# EAGLE board artik530_carrierboard (EAGLE 9.0.0)
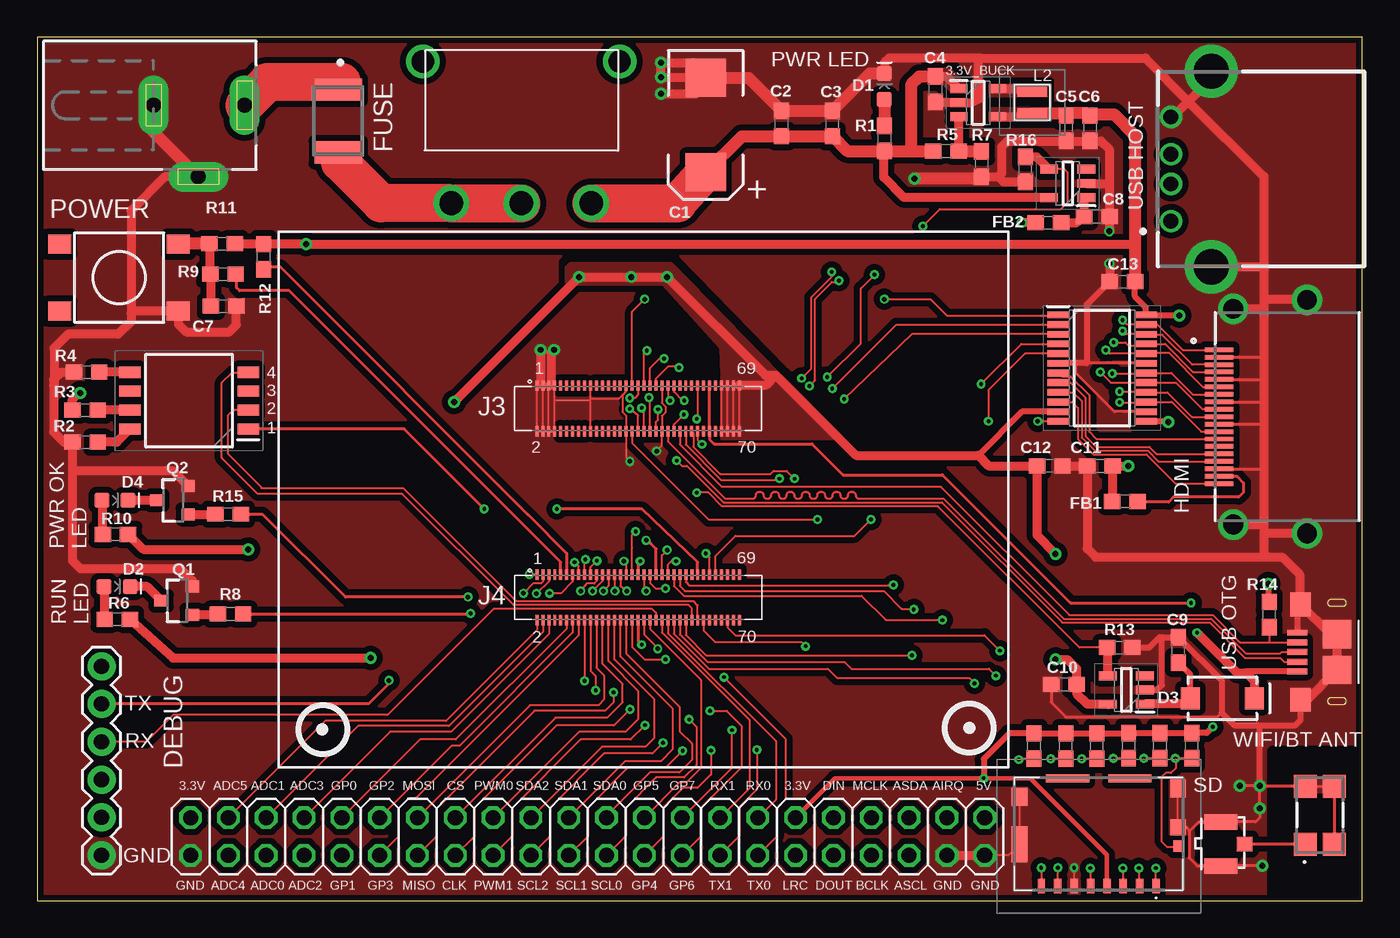
[diagram p4: board, top side]
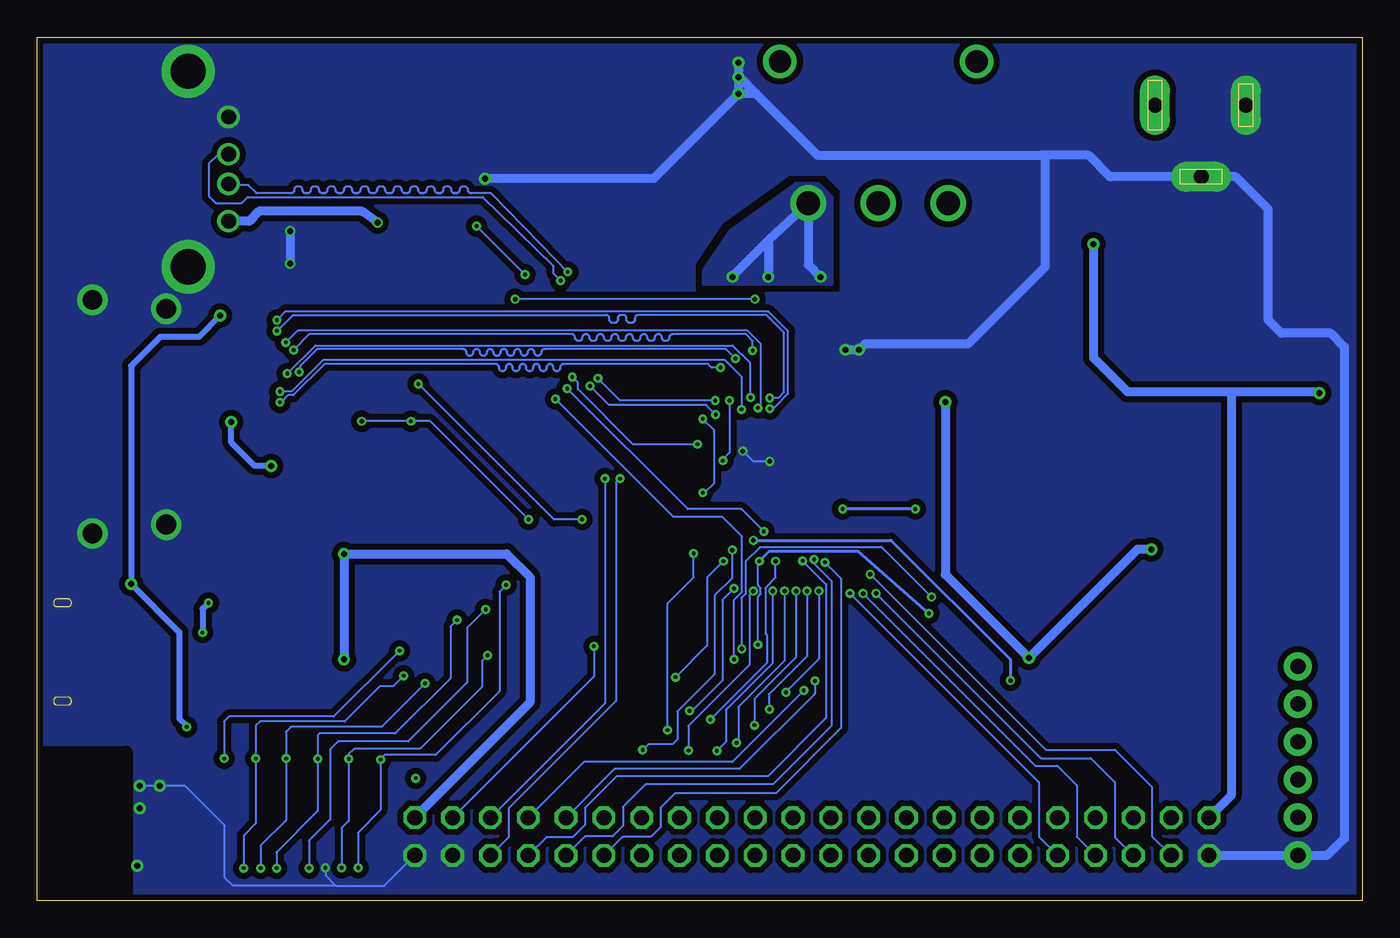
[diagram p5: board, bottom side, seen from below]

Size 89 x 58 mm. Coordinates in mm from the lower left corner, seen from the top.
Outline: 0,0 89,0 89,58 0,58 0,0
Copper layers (1*16): Top 0.035559375mm / dielectric 1.6mm / Bottom 0.035559375mm
Design rules "oshpark-2layer *": minimum track width 5mil, minimum drill 10mil, track to track 5mil, track to pad 5mil, pad to pad 5mil, via to via 5mil, smd to smd 5mil, copper to edge 15mil, drill to drill 6mil, minimum pad ring 5mil, minimum via ring 5mil, stop-mask expansion 2.5mil, vias tented up to drill 16mil, thermal gap 10mil
Net classes: 1 differential: width 0.127 mm, drill 0.3 mm, clearance 0.127 mm
bKeepout: area 78.2,2.9 to 83,4.7
tRestrict: area 78.1,2.9 to 80.4,4.7; area 83,8.6 to 89,10; area 83,7.9 to 84.3,8.6; area 83,0 to 89,2.8; area 83,4 to 84.3,7.4; area 83,2.8 to 84.3,3.6; area 84.3,4.7 to 86.9,6.8; area 87.3,4.7 to 89,6.8; area 88,6.8 to 89,8.6; area 88,2.7 to 89,4.7
bRestrict: area 83,0 to 89,10

## Footprints (pad centres in the part's own frame; a part is rotated, then mirrored left to right if it is on the bottom)
SOT95P284X122-5N = smd 1.15 x 0.6: 1 -1.3,0.953; 2 -1.3,0; 3 -1.3,-0.953; 4 1.3,-0.953; 5 1.3,0.953
146175-0001 = smd 1.54 x 1.54: 1 -0.97,-1.95; 2 0.97,-1.95; 3 0.97,1.95; 4 -0.97,1.95
EIA7343 = smd 2.55 x 2.7: A 3.17,0; C -3.17,0
0603 = smd 1.1 x 1: 1 -0.85,0; 2 0.85,0
LED-0603 = smd 1 x 1: A -0.877,0; C 0.877,0
SMA-DIODE = smd 1.27 x 1.47: A -2.15,0; C 2.15,0
MF-MSMF260-2 = smd 1.5 x 3.2: 1 -2.1,0; 2 2.1,0
SOT95P280X145-5N = smd 1.2 x 0.6: 1 -1.25,0.95; 2 -1.25,0; 3 -1.25,-0.95; 4 1.25,-0.95; 5 1.25,0.95
SOP65P640X120-24N = smd 1.475 x 0.45: 1 -2.938,3.575; 2 -2.938,2.925; 3 -2.938,2.275; 4 -2.938,1.625; 5 -2.938,0.975; 6 -2.938,0.325; 7 -2.938,-0.325; 8 -2.938,-0.975; 9 -2.938,-1.625; 10 -2.938,-2.275; 11 -2.938,-2.925; 12 -2.938,-3.575; 13 2.938,-3.575; 14 2.938,-2.925; 15 2.938,-2.275; 16 2.938,-1.625; 17 2.938,-0.975; 18 2.938,-0.325; 19 2.938,0.325; 20 2.938,0.975; 21 2.938,1.625; 22 2.938,2.275; 23 2.938,2.925; 24 2.938,3.575
DCJ0202 = drill 1 pad 2 long: 1 0,3.1; 2 4.8,0; 3 0,-3
10118193-0001LF = smd 0.4 x 1.35: D+ 0,2.675; D- -0.65,2.675; GND 1.3,2.675; ID 0.65,2.675; VCC -1.3,2.675 | smd 1.6 x 1.4: SHIELD$1 -3.2,2.45; SHIELD$2 3.2,2.45 | smd 1.9 x 1.9: SHIELD$3 -1.2,0; SHIELD$4 1.2,0
DF40C(2.0)-70DS-0.4V(51) = smd 0.2 x 0.7: 1 0,0; 2 0,-3.08; 3 0.4,0; 4 0.4,-3.08; 5 0.8,0; 6 0.8,-3.08; 7 1.2,0; 8 1.2,-3.08; 9 1.6,0; 10 1.6,-3.08; 11 2,0; 12 2,-3.08; 13 2.4,0; 14 2.4,-3.08; 15 2.8,0; 16 2.8,-3.08; 17 3.2,0; 18 3.2,-3.08; 19 3.6,0; 20 3.6,-3.08; 21 4,0; 22 4,-3.08; 23 4.4,0; 24 4.4,-3.08; 25 4.8,0; 26 4.8,-3.08; 27 5.2,0; 28 5.2,-3.08; 29 5.6,0; 30 5.6,-3.08; 31 6,0; 32 6,-3.08; 33 6.4,0; 34 6.4,-3.08; 35 6.8,0; 36 6.8,-3.08; 37 7.2,0; 38 7.2,-3.08; 39 7.6,0; 40 7.6,-3.08; 41 8,0; 42 8,-3.08; 43 8.4,0; 44 8.4,-3.08; 45 8.8,0; 46 8.8,-3.08; 47 9.2,0; 48 9.2,-3.08; 49 9.6,0; 50 9.6,-3.08; 51 10,0; 52 10,-3.08; 53 10.4,0; 54 10.4,-3.08; 55 10.8,0; 56 10.8,-3.08; 57 11.2,0; 58 11.2,-3.08; 59 11.6,0; 60 11.6,-3.08; 61 12,0; 62 12,-3.08; 63 12.4,0; 64 12.4,-3.08; 65 12.8,0; 66 12.8,-3.08; 67 13.2,0; 68 13.2,-3.08; 69 13.6,0; 70 13.6,-3.08
UE27AC54100 = drill 1 pad 1.5: 1 -3.5,0; 2 -1,0; 3 1,0; 4 3.5,0 | drill 2.38 pad 3.58: 5 -6.57,-2.71; 6 6.57,-2.71
FTDI_BASIC = drill 1.016 pad 1.88: CTS 10.16,0; DTR 0,0; GND 12.7,0; RXI 2.54,0; TXO 5.08,0; VCC 7.62,0
10029449-111RLF_1 = smd 0.3 x 1.9: 1 4.5,0.95; 2 4,0.95; 3 3.5,0.95; 4 3,0.95; 5 2.5,0.95; 6 2,0.95; 7 1.5,0.95; 8 1,0.95; 9 0.5,0.95; 10 0,0.95; 11 -0.5,0.95; 12 -1,0.95; 13 -1.5,0.95; 14 -2,0.95; 15 -2.5,0.95; 16 -3,0.95; 17 -3.5,0.95; 18 -4,0.95; 19 -4.5,0.95 | drill 1.33 pad 2.03: 20 -7.25,0; 21 -7.85,-4.95; 22 7.85,-4.95; 23 7.25,0
1051620001 = smd 0.5 x 1: 1 3.85,-3.335; 2 2.75,-3.335; 3 1.65,-3.335; 4 0.55,-3.335; 5 -0.55,-3.335; 6 -1.65,-3.335; 7 -2.75,-3.335; 8 -3.85,-3.335 | smd 0.72 x 0.78: 9 5.36,-0.655 | smd 1.05 x 1.08: 10 5.325,0.615 | smd 1.05 x 1.2: 11 5.325,3.225; 12 -5.325,2.655 | smd 1.05 x 2.39: 13 -5.325,-0.53 | smd 2.91 x 0.55: 14 -2.095,3.9; 15 2.095,3.9
NRH2412T2R2MNGH = smd 0.7 x 2: 1 -0.725,0; 2 0.725,0
SOT23-3 = smd 0.8 x 0.9: 1 -0.95,-1; 2 0.95,-1; 3 0,1.1
TACTILE_SWITCH_SMD_6.2MM_TALL = smd 1.55 x 1.3: A1 -3.975,-2.25; A2 3.975,-2.25; B1 -3.975,2.25; B2 3.975,2.25
SOIC127P844X265-8N = smd 1.45 x 0.75: 1 -3.975,1.905; 2 -3.975,0.635; 3 -3.975,-0.635; 4 -3.975,-1.905; 5 3.975,-1.905; 6 3.975,-0.635; 7 3.975,0.635; 8 3.975,1.905
2X22 = drill 1.016 octagon: 1 -25.4,-1.27; 2 -25.4,1.27; 3 -22.86,-1.27; 4 -22.86,1.27; 5 -20.32,-1.27; 6 -20.32,1.27; 7 -17.78,-1.27; 8 -17.78,1.27; 9 -15.24,-1.27; 10 -15.24,1.27; 11 -12.7,-1.27; 12 -12.7,1.27; 13 -10.16,-1.27; 14 -10.16,1.27; 15 -7.62,-1.27; 16 -7.62,1.27; 17 -5.08,-1.27; 18 -5.08,1.27; 19 -2.54,-1.27; 20 -2.54,1.27; 21 0,-1.27; 22 0,1.27; 23 2.54,-1.27; 24 2.54,1.27; 25 5.08,-1.27; 26 5.08,1.27; 27 7.62,-1.27; 28 7.62,1.27; 29 10.16,-1.27; 30 10.16,1.27; 31 12.7,-1.27; 32 12.7,1.27; 33 15.24,-1.27; 34 15.24,1.27; 35 17.78,-1.27; 36 17.78,1.27; 37 20.32,-1.27; 38 20.32,1.27; 39 22.86,-1.27; 40 22.86,1.27; 41 25.4,-1.27; 42 25.4,1.27; 43 27.94,-1.27; 44 27.94,1.27
500SSP1S1M6QEA = drill 1.6: 1 -4.8,-5.4; 2 -0.1,-5.4; 3 4.6,-5.4 | drill 1.5: 4 -6.705,4.13; 5 6.505,4.13
U.FL-R-SMT(10) = smd 1.05 x 2.2: 1 -1.475,0.2; 2 1.475,0.2 | smd 1 x 1.05: 3 0,-1.4

## Placement (x,y rotation side)
3.3V_BUCK  LM3671MF-3.3_NOPB  [SOT95P284X122-5N]  63.2,53.6 0 top
ANT1  146175-0001  [146175-0001]  86.16,5.74 0 top
C1  100uF  [EIA7343]  44.9,52.1 270 top
C2  10uF  [0603]  50,52.2 90 top
C3  0.1uF  [0603]  53.4,52.2 90 top
C4  4.7uF  [0603]  60.33,54.51 270 top
C5  10uF  [0603]  69.11,51.88 270 top
C6  0.1uF  [0603]  70.71,51.88 270 top
C7  1.0uF  [0603]  12.52,39.93 180 top
C8  4.7uF  [0603]  71.17,45.94 0 top
C9  4.7uF  [0603]  76.64,16.84 90 top
C10  10uF  [0603]  68.95,14.54 180 top
C11  0.1uF  [0603]  71.37,29.2 180 top
C12  0.1uF  [0603]  68,29.2 0 top
C13  0.1uF  [0603]  72.89,41.58 180 top
D1  Red  [LED-0603]  56.9,54.7 90 top
D2  GREEN  [LED-0603]  5.37,21.1 0 top
D3  3A/40V/500mV  [SMA-DIODE]  79.6,13.59 0 top
D4  BLUE  [LED-0603]  5.23,26.89 0 top
F1  MF-MSMF260-2  [MF-MSMF260-2]  20.22,52.37 270 top
FB1  120Ω  [0603]  73.06,26.81 0 top
FB2  30Ω  [0603]  67.92,45.54 180 top
IC2  TPS2051BDBVR  [SOT95P280X145-5N]  73.15,14.15 180 top
IC3  TPD12S016PWR  [SOP65P640X120-24N]  71.52,35.77 0 top
IC4  TPS2051BDBVR  [SOT95P280X145-5N]  69.21,48.18 180 top
J1  DCJ0202  [DCJ0202]  10.82,53.43 270 top
J2  10118193-0001LF  [10118193-0001LF]  87.3,16.7 90 top
J3  DF40C(2.0)-70DS-0.4V(51)  [DF40C(2.0)-70DS-0.4V(51)]  33.56,34.6 0 top
J4  DF40C(2.0)-70DS-0.4V(51)  [DF40C(2.0)-70DS-0.4V(51)]  33.56,21.91 0 top
J5  UE27AC54100  [UE27AC54100]  76.15,49.14 90 top
J6  6_PIN_SERIAL_CABLEPTH  [FTDI_BASIC]  4.32,15.74 270 top
J7  10029449-111RLF  [10029449-111RLF_1]  80.34,32.51 90 top
J8  1051620001  [1051620001]  71.3,4.31 0 top
L2  NRH2412T2R2MNGH  [NRH2412T2R2MNGH]  66.83,53.61 270 top
Q1  600mA/40V  [SOT23-3]  9.42,20.15 90 top
Q2  600mA/40V  [SOT23-3]  9.14,26.89 90 top
R1  470  [0603]  56.9,51.2 270 top
R2  1k  [0603]  3.21,30.8 180 top
R3  1k  [0603]  3.21,32.95 180 top
R4  1k  [0603]  3.31,35.5 180 top
R5  10k  [0603]  61.03,50.35 180 top
R6  470  [0603]  5.38,18.9 0 top
R7  100k  [0603]  63.43,49.48 270 top
R8  10k  [0603]  12.98,19.25 0 top
R9  33  [0603]  12.48,42.07 0 top
R10  470  [0603]  5.26,24.61 0 top
R11  100k  [0603]  12.42,44.13 180 top
R12  100k  [0603]  15.21,43.25 270 top
R13  10k  [0603]  72.7,17 180 top
R14  100k  [0603]  82.75,19.21 90 top
R15  10k  [0603]  12.83,25.95 0 top
R16  100k  [0603]  66.37,49.12 90 top
R17  10k  [0603]  77.54,10.41 90 top
R18  51k  [0603]  66.95,10.38 90 top
R19  51k  [0603]  71.17,10.38 90 top
R20  10k  [0603]  69.09,10.38 90 top
R21  51k  [0603]  75.41,10.41 90 top
R22  51k  [0603]  73.3,10.41 90 top
S1  MOMENTARY-SWITCH-SPST-SMD-6.2MM-TALL  [TACTILE_SWITCH_SMD_6.2MM_TALL]  5.5,41.85 0 top
S3  218-4LPST  [SOIC127P844X265-8N]  10.2,33.59 180 top
SV1  TEST HEADER  [2X22]  35.7,4.3 0 top
SW1  500SSP1S1M6QEA  [500SSP1S1M6QEA]  32.61,52.25 0 top
U$3  U.FL-R-SMT(10)  [U.FL-R-SMT(10)]  79.69,3.8 90 top

## Tracks (layer width: path | path; a pad name or v marks a point on that pad's centre or on a via)
3.3V  (via drill 0.25 pad 0.6, 0.4 pad 0.8)
  Top 0.127: 74.4,39.4 IC3.24
  Top 0.305: J8.4 71.85,3.08 66.7,8.23 v63.57,8.23 53.59,8.23 SV1.34 | 73.28,11.23 R22.2
  Top 0.406: C13.1 73.74,40.56 74.46,39.84 IC3.24 76.66,39.34 v76.7,39.3 | v82.7,21.28 82.7,20.11 R14.2 | v63.57,8.23 63.57,9.52 65.29,11.23 R18.2 R20.2 R19.2 73.28,11.23 | R22.2 R21.2 R17.2 78.55,11.26 v78.97,11.68
  Top 0.61: R3.2 2.36,33.65 2.8,34.09 v2.9,34.09 | 3.3V_BUCK.4 66.58,52.65 L2.2 | 73.74,44.09 73.73,44.1 v18.05,44.1 15.26,44.1 R12.1 13.3,44.1 R11.1
  Top 0.813: 68.94,52.89 C5.1 | L2.2 68.94,52.89 | 68.94,52.89 70.55,52.89 C6.1 70.78,52.8 72.34,52.8 73.74,51.4 73.74,44.09 C13.1
  Bottom 0.406: v76.7,39.3 78.13,37.87 80.75,37.87 82.7,35.91 v82.7,21.28 79.45,18.03 79.45,12.21 78.97,11.73 v78.97,11.68
  Bottom 0.61: 18.1,44.1 v18.05,44.1 18.05,36.46 15.77,34.18 8.63,34.18 | 8.63,34.18 3,34.18 v2.9,34.09 | 8.63,34.18 8.8,34.02 8.8,7.07 SV1.2
  pour Top (no thermals): 67.82,53.26 67.84,53.23 67.84,52.4 67.87,52.37 64.01,52.37 64.01,53.26 64.03,53.26
5V  (via drill 0.4 pad 0.8)
  Top 0.127: J3.66 J3.65 | J3.68 J3.67 | 47.16,34.5 J3.70 J3.68 | 47.16,34.5 J3.69 | J3.66 J3.64 J3.63 J3.65 | J3.66 J3.68 | J3.65 J3.67 | J3.67 47.06,34.6 47.16,34.5
  Top 0.406: IC3.11 66.14,32.84 63.2,29.9
  Top 0.61: 68.45,23.35 v68.4,23.3 67.16,24.55 C12.1 63.9,29.2 63.2,29.9 55,29.9 49.6,35.3 | v28,33.5 28.1,33.5 28.1,33.6 v36.4,41.9 v39.9,41.9 v42.3,41.9 48.9,35.3 49.6,35.3 | R6.2 9.13,16.3 v22.4,16.3 | 49.6,35.3 48.9,34.6 J3.69 | 3.3V_BUCK.1 61.1,55.36 C4.1 | R10.2 7.12,23.59 v14.17,23.59 | 71.95,13.15 IC2.5 70.54,13.2 69.8,13.93 C10.1 69.8,15.59 69.19,16.2 v68.4,16.2 | IC4.5 58.22,47.23 56.87,48.59 56.87,50.35
  Top 0.813: C1.A 47.32,51.35 C2.1 C3.1 54.4,50.35 56.87,50.35 R1.2 58.77,50.35 | 58.77,50.35 R5.2 | C4.1 59.25,55.36 58.7,54.81 58.7,50.43 58.77,50.35
  Top 2.54: SW1.3 43.02,46.85 C1.A
  Bottom 0.61: v68.4,16.2 v68.4,23.3 57.47,23.3 55.9,21.74 55.9,13.31 SV1.44 | v28,33.5 28,21.9 v22.4,16.3 15.11,23.59 v14.17,23.59 | v36.4,41.9 37.21,42.71 SW1.3 39.9,44.36 | 39.9,44.36 v39.9,41.9 | 39.9,44.36 42.26,42 42.3,42 v42.3,41.9
  pour Top (no thermals): 45.94,35.3 45.94,31 53.9,31 54.06,31.2 50,35.3
  pour Bottom (no thermals): 38.05,48.2 42.44,45.03 44.29,42.3 44.29,41.44 44.3,41.43 35.63,41.43 35.59,41.39 35.59,47.26 36.49,48.16
  pour Top (no thermals): 45.99,35.42 45.93,37.1 42,41.4 42,41.59 41.97,41.39 35.69,41.39 35.56,41.52 35.56,42.58 35.79,42.81 42.59,42.81 49.87,35.38 46.1,35.43
  pour Top (no thermals): 59.87,55.9 61.29,55.9 62.41,54.78 62.41,54.3 61.39,54.3 60.83,54.86 59.87,54.86
GND  (via drill 0.25 pad 0.6, 0.3 pad 0.6, 0.4, 0.4 pad 0.8)
  Top 0.127: 74.5,32.8 IC3.14 | J3.4 J3.3 J3.5 | J3.6 J3.5 | 34.76,33.6 J3.8 J3.6 | 34.76,33.6 J3.7 34.5,34.6 J3.5 | 69,36.09 IC3.6 | J3.20 37.16,33.6 | 37.16,33.6 37.16,33.7 | 37.16,33.7 J3.19 | J3.31 39.56,34.22 39.31,33.97 | 39.31,33.97 39.31,32.83 39.56,32.58 J3.32 39.56,29.74 v39.8,29.5 | 39.31,33.97 39.04,33.7 37.16,33.7 | 37.16,33.6 34.76,33.6 | J3.43 41.96,33.43 42.19,33.2 42.19,32.8 41.96,32.57 J3.44 41.96,30.56 v41.6,30.2 | 33.8,34.76 33.64,34.6 J3.1 J3.2 J3.4 | J3.6 J3.4 | J8.6 69.65,2.18 69.64,2.18 v69.64,2.2 | SV1.43 65.22,3.03 J8.13 J8.12 | J8.10 J8.11
  Top 0.2: J7.2 82.31,36.51 82.4,36.42 | J7.5 82.36,35.01 82.4,35.05 | J7.8 82.28,33.51 82.4,33.4 | J7.11 82.26,32.01 82.4,31.87 | J7.17 82.3,29.01 82.4,29.1 | IC3.14 72.36,32.84 69.77,35.43 69.77,36.09 | IC3.19 70.5,36.09 | v82.1,7.7 85.17,7.7 ANT1.4 ANT1.3 ANT1.2 | v82.1,7.7 v82.1,6.2 82.1,5.55 81.84,5.28 U$3.2 78,5.27 77.42,4.69 | v82.28,2.34 82.27,2.32 U$3.1 77.91,2.32 77.37,2.87 77.37,4.64 77.42,4.69 | J8.10 77.18,4.93 77.42,4.69 | v82.1,7.7 v80.78,7.7 | C10.2 68.1,13.32 69.09,12.34 79.27,12.34 79.55,12.62
  Top 0.406: C13.2 70.5,40.04 70.5,36.09 69.77,36.09 69,36.09 | J2.SHIELD$2 84.62,19.67 J2.GND | R13.1 74.69,17 75.38,17.69 75.54,17.69 | 75.54,17.69 C9.2 79.55,14.78 79.55,12.62 80.39,11.78 81.99,11.78 | IC2.2 75.21,14.15 75.54,14.47 75.54,17.69 | J2.SHIELD$1 84.86,12.14 84.5,11.78 81.99,11.78 | v82.1,7.7 82.1,11.67 81.99,11.78
  Top 0.61: 87.75,17.9 J2.SHIELD$4 | 1.1,34.62 1.1,34.99 1.6,35.49 2.45,35.49 R4.2 2.7,35.73 | 1.1,34.62 1.1,31.49 1.79,30.8 R2.2 2.36,28.85 | 2.36,28.85 2.36,22.84 2.9,22.3 9.6,22.3 10.42,21.48 Q1.2 | v33.8,37 33.8,34.76 J3.3 | C1.C 44.87,55.3 v41.9,55.3 v41.9,56.3 44.07,56.3 45.1,55.27 | v41.9,54.2 44.23,54.2 45.3,55.27 | v34.7,37 34.5,36.8 34.5,34.6 | J2.SHIELD$4 86.85,17.9 J2.SHIELD$2 84.8,19.95 84.8,21.9 83.62,23.08 82.62,23.08 | J2.SHIELD$4 J2.SHIELD$3 85.3,13.5 J2.SHIELD$1 | C4.2 60.38,53.6 3.3V_BUCK.2 62.7,53.6 63.22,53.84 63.22,56.55 63.32,56.6 | 63.32,56.6 57.21,56.6 56.92,56.31 56.92,55.6 D1.C | J1.2 8.58,48.63 6.3,46.35 6.3,39.47 | 6.3,39.47 6.3,38.91 5.43,38.05 2.08,38.05 1.14,37.1 1.14,34.66 1.1,34.62 | 6.3,39.47 6.43,39.6 S1.A2 9.47,38.73 10.01,38.2 12.9,38.2 13.37,38.66 C7.1 | Q2.2 9.14,28.85 2.36,28.85 | C12.2 70.42,29.2 70.59,29.02 C11.2 70.52,23.65 71.09,23.08 82.62,23.08 | 82.4,42.72 82.4,40.46 | 82.4,40.46 82.4,39.75 | 82.4,39.75 82.4,36.42 82.4,35.05 82.4,33.4 82.4,31.87 82.4,29.1 82.4,25.47 | 82.4,25.47 82.4,24.46 | 82.4,24.46 82.4,23.31 82.62,23.08 | v72.01,42.79 72.04,42.76 C13.2 | 72.01,48.05 72.01,50.47 71.44,51.03 C6.2 C5.2 65.18,51.03 64.79,50.64 64.79,48.87 64.56,48.63 | 72.01,48.05 v72.01,44.98 v72.02,44.99 C8.2 | R7.2 64.56,48.63 | IC4.2 71.88,48.18 72.01,48.05 | R16.1 64.91,48.27 64.56,48.63 | J7.23 82.39,39.76 82.4,39.75 | J7.22 82.5,40.36 82.4,40.46 | J7.21 82.6,24.66 82.4,24.46 | J7.20 82.18,25.26 82.4,25.47 | J5.5 82.25,42.57 82.4,42.72 | 63.32,56.6 74.43,56.6 77.32,53.67 | 77.32,53.67 82.4,48.64 82.4,42.72 | 77.32,53.67 78.86,55.26 J5.6 | 77.32,53.67 76.24,52.64 J5.4
  Top 0.61: SV1.41 SV1.43
  Top 0.813: C1.C 45.1,55.27 45.3,55.27 47.78,55.27 C2.2 C3.2 55.93,55.58 D1.C 56.92,55.6 | J1.3 7.82,51.63 J1.2 | R7.2 63.3,48.5 v58.92,48.5
  Bottom 0.127: v39.8,29.5 40.9,29.5 v41.6,30.2 | v69.64,2.2 69.64,1.7 68.95,1 | 68.95,1 68.93,0.99 65.69,0.99 SV1.43 | 68.95,1 75.86,1 76.4,1.54 76.4,5.05 79.05,7.7 v82.1,7.7
  Bottom 0.61: 21.66,50.05 21.3,50.05 21.3,42.6 26.5,37.4 33.4,37.4 v33.8,37 v34.7,37 | 21.66,50.05 36.55,50.05 40.75,54.25 | 40.75,54.25 41.8,55.3 v41.9,55.3 | v41.9,56.3 v41.9,54.2 | v41.9,54.2 41.85,54.25 40.75,54.25 | v41.9,54.2 47.6,48.5 v58.92,48.5 | 10.92,48.53 J1.2 | J1.2 16.94,48.63 18.38,50.07 21.64,50.07 21.66,50.05 | J1.2 8.5,48.63 6.32,46.45 6.32,39.01 5.43,38.12 2.13,38.12 1.2,37.19 1.2,4.18 2.34,3.04 J6.GND 4.33,3.03 SV1.1 | v72.01,44.98 v72.01,42.79
  pour Bottom (isolate 0.406, rank 2, no thermals): 0,58 0,0.2 0.2,0 88.96,-0.1 88.96,57.9
  pour Top (isolate 0.406, rank 2, no thermals): 0,58 0,0.2 0.2,0 88.93,0 88.93,58
N$1
  Top 1.27: F1.1 20.47,54.72 20.47,54.99
  Top 2.54: J1.1 15.48,54.99 20.47,54.99
N$2
  Top 1.27: F1.2 20.34,50.14 20.34,49.6
  Top 2.54: SW1.2 SW1.1 23.09,46.85 20.34,49.6
N$3
  Top 0.61: 3.3V_BUCK.5 66.61,54.55 L2.1
  pour Top (no thermals): 64.01,54.88 67.69,54.86 67.82,54.73 67.82,54 63.98,54 64.01,54.83
N$4
  Top 0.813: D1.A R1.1
N$5
  Top 0.61: S3.8 5.34,30.8 R2.1
N$6
  Top 0.61: S3.7 R3.1
N$7
  Top 0.61: S3.5 R4.1
N$8
  Top 0.61: D2.A 4.49,19.24 R6.1
N$9
  Top 0.61: R5.1 61.9,50.37 3.3V_BUCK.3
  Top 0.813: R5.1 63.4,50.35 R7.1
N$10
  Top 0.61: Q1.3 7.37,21.1 D2.C
N$11
  Top 0.61: R8.1 12.08,19.2 Q1.1
N$12
  Top 0.61: C7.2 11.67,42.03 R9.1 11.57,42.13 R11.2
  Top 0.813: R11.2 9.46,44.13 S1.B2
N$13
  Top 0.61: D4.A 4.35,24.66 R10.1
N$14  (via drill 0.4 pad 0.8)
  Top 0.406: IC3.13 74.44,32.18 75.94,32.18 v75.97,32.15
  Top 0.61: v73.3,29.2 C11.1 72.22,26.83 FB1.1
  Bottom 0.406: v73.3,29.2 74.39,29.2 75.97,30.78 v75.97,32.15
N$15
  Top 0.406: C9.1 77.42,15.22 77.42,13.62 D3.A
  Top 0.61: D3.A 77.06,13.2 IC2.1
N$16
  Top 0.127: IC3.7 68.82,35.21 69.4,35.21 70.66,33.95 70.66,31.5 71.16,31.01 J7.13
N$17
  Top 0.127: IC3.8 69.41,34.8 70.41,33.79 70.41,31.21 71.14,30.48 74.71,30.48 75.17,30.01 J7.15
N$18
  Top 0.127: IC3.9 69.56,34.15 70.15,33.55 70.15,31.1 71.04,30.22 74.6,30.22 75.32,29.51 J7.16
N$19
  Top 0.127: IC3.10 69.5,33.49 69.9,33.1 69.9,31 70.93,29.97 74.5,29.97 76.45,28.01 J7.19
N$20
  Top 0.61: Q2.3 D4.C
N$21
  Top 0.61: Q2.1 11.96,25.94 R15.1
N$22
  Top 0.2: J7.18 80.58,28.51 81.02,28.06 81.02,27.43 80.69,27.1 76.33,27.1 76,26.77 73.95,26.77 FB1.2
N$23
  Top 0.61: FB2.1 69.79,45.54 C8.1 70.32,47.09 IC4.1
N$24  (via drill 0.4)
  Top 0.61: FB2.2 v66.14,45.54
  Bottom 0.61: v66.14,45.54 67.18,46.3 74.11,46.3 74.77,45.64 J5.1
N$32
  Top 0.2: ANT1.1 81.11,3.79 U$3.3
VCC5P0_OTG  (via drill 0.25 pad 0.6)
  Top 0.127: 77.6,20 v77.5,20
  Top 0.2: J3.59 J3.60 45.16,30.98 45.46,30.68 52.04,30.68 54.13,28.6 60.8,28.6 69.4,20 v77.5,20
  Top 0.406: J2.VCC 81.3,15.4 81.2,15.3
  Top 0.61: v77.9,18 80.6,15.3 81.2,15.3 81.75,14.75 D3.C
  Bottom 0.406: v77.5,20 77.9,19.6 v77.9,18
VSYS_IO_3P3  (via drill 0.25 pad 0.6)
  Top 0.127: 29.05,19.25 v29.1,19.3
  Top 0.2: v40.5,22.8 40.37,22.66 J4.35 | R8.2 29.05,19.25 | v40.6,17.19 40.37,17.43 J4.36
  Bottom 0.127: v40.5,22.8 40.6,22.7 40.6,21.19 40.41,21 40.41,20.6 40.6,20.41 v40.6,17.19
  Bottom 0.2: v29.1,19.3 33.85,23.45 39.85,23.45 v40.5,22.8
XADC0  (via drill 0.3 pad 0.6)
  Top 0.127: J4.3 33.97,21.44 33.83,21.31 33.31,21.31 v32.66,20.65
  Bottom 0.127: v32.66,20.65 21.58,9.57 18.23,9.57 16.61,7.95 16.61,4.26 SV1.5
XADC1
  Top 0.127: J4.4 33.97,18.04 27.66,11.73 21.54,11.73 SV1.6
XADC2  (via drill 0.3 pad 0.6)
  Top 0.127: J4.5 34.37,21.46 v33.53,20.62
  Bottom 0.127: v33.53,20.62 21.97,9.06 20.5,9.06 19.18,7.74 19.18,4.29 SV1.7
XADC3
  Top 0.127: J4.6 34.37,17.9 27.81,11.35 23.7,11.35 SV1.8
XADC4  (via drill 0.3 pad 0.6)
  Top 0.127: J4.1 33.06,21.91 v33.05,21.92
  Bottom 0.127: SV1.3 14.12,4.31 14.12,7.64 16.61,10.13 21.26,10.13 v33.05,21.92
XADC5
  Top 0.127: J4.2 33.56,18.17 27.46,12.06 19.33,12.06 SV1.4
XAUDIO_IRQ  (via drill 0.25 pad 0.6)
  Top 0.127: J4.58 44.77,18.14 45.54,17.37 51.33,17.37 v51.61,17.09
  Bottom 0.127: v51.61,17.09 51.61,15.06 SV1.42
XAUDIO_SCL  (via drill 0.25 pad 0.6)
  Top 0.127: J3.52 43.56,30.63 45.92,28.27 49.78,28.27 arc90 v49.86,28.34
  Bottom 0.127: v49.86,28.34 50.11,28.09 50.11,13.41 57.33,6.19 57.33,4.27 SV1.39
XAUDIO_SDA  (via drill 0.25 pad 0.6)
  Top 0.127: J3.54 44.07,31.41 44.07,30.48 45.87,28.67 49.25,28.67 49.45,28.88 50.34,28.88 v50.87,28.34
  Bottom 0.127: SV1.40 50.87,13.26 v50.87,28.34
XBOOT_CONFIG0  (via drill 0.25 pad 0.6)
  Top 0.127: 34.92,26.3 v34.9,26.3
  Top 0.2: J4.55 44.37,22.73 40.62,26.3 34.92,26.3 | v30.02,26.31 24.65,31.68 S3.1
  Bottom 0.2: v30.02,26.31 v34.89,26.31 v34.9,26.3
XBOOT_CONFIG1
  Top 0.127: 14.21,32.99 S3.2 13.23,32.95 13.2,32.99 12.8,32.59 12.8,30.02 15.06,27.76 15.06,27.71 24.59,27.71 32.19,20.1 44.1,20.1 44.37,19.84 J4.56
XBOOT_CONFIG3
  Top 0.127: 14.07,35.39 S3.4 13.1,35.49 12.4,34.79 12.4,29.73 14.81,27.33 24.52,27.33 31.99,19.85 43.75,19.85 43.97,19.63 J4.54
XDEBUG_RX
  Top 0.127: J4.42 41.56,19.34 41.31,19.59 30.64,19.59 23.52,12.47 9.12,12.47 7.31,10.66 J6.TXO
XDEBUG_TX  (via drill 0.3 pad 0.6)
  Top 0.2: J4.41 41.56,23.63 41.2,24 v40.9,24.2 | v23.63,14.78 23.63,14.59 22.27,13.23 4.34,13.23 J6.RXI
  Bottom 0.2: v40.9,24.2 31.65,24.2 23.63,16.19 v23.63,14.78
XGPA15  (via drill 0.25 pad 0.6)
  Top 0.127: R13.2 70,17 60.51,26.49 45.99,26.49 45.08,27.4 v44.3,27.4 | J3.55 44.36,32.42 v44.3,32.36
  Top 0.61: IC2.4 71.9,16.95 R13.2
  Bottom 0.127: v44.3,32.36 43.56,31.62 43.56,31.49 43.56,31.36 43.56,28.01 44.17,27.4 v44.3,27.4
XGPA16  (via drill 0.25 pad 0.6)
  Top 0.127: v53.06,35.17 55.32,37.44 55.32,41.12 56.26,42.06 | 56.28,42.08 56.26,42.06 | 56.26,42.06 v56.23,42.06 | v59.48,45.31 60.63,46.45 68.76,46.45 69.21,46.91 69.21,48.89 68.97,49.13 IC4.4 | J3.56 44.36,30.95 v44.65,30.65
  Top 0.61: R16.2 67.12,49.97 IC4.4
  Bottom 0.127: v53.06,35.17 52.68,34.79 52.68,34.36 48.97,30.65 v44.65,30.65 | v56.23,42.06 v59.48,45.31
XGPA21  (via drill 0.25 pad 0.6, 0.3 pad 0.6)
  Top 0.127: J4.61 45.56,23.16 46.9,24.5 54.9,24.5 v56,25.6 | v63.91,32.2 v63.9,32.2 63.9,34.3 66.34,36.74 IC3.5 | v67.2,32.2 IC3.12
  Bottom 0.127: v56,25.6 62.6,32.2 v63.9,32.2 v67.2,32.2
XGPIO0
  Top 0.127: J4.12 35.56,18.27 28.12,10.82 25.7,10.82 SV1.10
XGPIO1  (via drill 0.25 pad 0.6)
  Top 0.127: J4.13 35.97,21.43 35.18,20.65 v34.41,20.65
  Bottom 0.127: SV1.9 21.72,4.29 21.72,7.96 v34.41,20.65
XGPIO2
  Top 0.127: J4.14 35.97,18 28.37,10.41 27.84,10.41 SV1.12
XGPIO3
  Top 0.127: J4.16 36.37,17.82 25.4,6.85 24.94,6.85 24.28,6.19 24.28,4.31 SV1.11
XGPIO4  (via drill 0.25 pad 0.6, 0.3 pad 0.6)
  Top 0.127: J4.37 40.77,20.94 v40.9,20.8 | v45.26,10.08 45.26,8.48 44.35,7.57 43.38,7.57 42.03,6.22 42.03,4.29 SV1.25
  Bottom 0.127: v40.9,20.8 41.15,20.55 41.15,15.84 45.26,11.73 v45.26,10.08
XGPIO5
  Top 0.127: J4.40 41.16,18.23 44.58,14.82 44.58,8.91 43.61,7.95 43.16,7.95 SV1.26
XGPIO6  (via drill 0.25 pad 0.6)
  Top 0.127: J4.39 41.16,21.34 41.52,20.98 v42.2,20.98 | v45.19,12.75 46.3,12.75 47.32,11.73 47.32,8.94 44.6,6.22 44.6,4.31 SV1.27
  Bottom 0.127: v45.19,12.75 45.03,12.75 42.99,14.79 42.99,20.19 v42.2,20.98
XGPIO7  (via drill 0.25 pad 0.6)
  Top 0.127: v46.66,11.45 46.66,8.91 SV1.28 | J4.59 45.16,23.05 v44.91,23.31
  Bottom 0.127: v46.66,11.45 46.66,19.96 44.91,21.71 v44.91,23.31
XHDMI_CEC  (via drill 0.3 pad 0.6)
  Top 0.127: IC3.1 68.54,39.3 61.1,39.3 60,40.4 v56.9,40.4 | v40.8,40.4 39.96,39.56 J3.33
  Bottom 0.127: v40.8,40.4 v56.9,40.4
XHDMI_HPD  (via drill 0.25 pad 0.6)
  Top 0.127: J3.34 39.96,30.74 45.1,25.6 v52.4,25.6 | v63.4,34.7 66.09,37.4 IC3.4
  Bottom 0.127: v52.4,25.6 54.3,25.6 v63.4,34.7
XHDMI_I2C_SCL  (via drill 0.25 pad 0.6)
  Top 0.127: J4.33 39.97,23.7 39.97,24.56 v40.2,24.8 | v53.4,34.4 57.69,38.7 IC3.2
  Bottom 0.127: v40.2,24.8 41.7,26.3 45.3,26.3 v53.4,34.4
XHDMI_I2C_SDA  (via drill 0.25 pad 0.6)
  Top 0.127: IC3.3 58.75,38.05 v54.2,33.7 | v42.2,16.2 40.8,16.2 39.97,17.04 J4.34
  Bottom 0.127: v42.2,16.2 42.2,20.21 41.67,20.74 41.65,20.75 41.65,24.45 42.98,25.78 46.28,25.78 v54.2,33.7
XHDMI_TX0_N  (via drill 0.25 pad 0.6)
  Top 0.127: J3.39 41.16,35.76 41.81,36.41 v42.1,36.41 | v71.4,35.5 72.11,34.8 IC3.17 76.47,34.8 78.26,33.01 J7.9
  Bottom 0.127: v71.4,35.5 71.3,35.61 71.3,35.94 70.19,37.05 60.4,37.05 arc90 60.18,36.82 60.18,36.82 arc-90 59.96,36.59 59.94,36.59 arc-90 59.72,36.82 59.72,36.82 arc90 59.5,37.05 59.48,37.05 arc90 59.26,36.82 59.26,36.82 arc-90 59.04,36.59 59.03,36.59 arc-90 58.81,36.82 58.81,36.82 arc90 58.58,37.05 58.57,37.05 arc90 58.35,36.82 58.35,36.82 arc-90 58.12,36.59 58.11,36.59 arc-90 57.89,36.82 57.89,36.82 arc90 57.67,37.05 57.65,37.05 arc90 57.43,36.82 57.43,36.82 arc-90 57.21,36.59 57.2,36.59 arc-90 56.97,36.82 56.97,36.82 arc90 56.75,37.05 56.74,37.05 arc90 56.52,36.82 56.52,36.82 arc-90 56.3,36.59 56.28,36.59 arc-90 56.06,36.82 56.06,36.82 arc90 55.84,37.05 55.82,37.05 arc90 55.6,36.82 55.6,36.82 arc-90 55.38,36.59 55.37,36.59 arc-90 55.14,36.82 55.14,36.82 arc90 54.92,37.05 42.74,37.05 v42.1,36.41
XHDMI_TX0_P  (via drill 0.25 pad 0.6)
  Top 0.127: 74.51,35.39 IC3.18 | J3.40 41.16,33.64 v41.1,33.8 | v72.2,35.4 74.41,35.4 IC3.18 | IC3.18 76.18,35.45 77.63,33.99 79.38,33.99 J7.7
  Bottom 0.127: v41.1,33.8 41.1,36.1 42.3,37.3 70.3,37.3 v72.2,35.4
XHDMI_TX1_N  (via drill 0.25 pad 0.6)
  Top 0.127: v71.79,36.99 72.03,36.74 IC3.20 74.51,36.8 75.99,36.8 78.29,34.51 J7.6 | v40.95,36.95 40.76,36.77 J3.37
  Bottom 0.127: v40.95,36.95 40.95,37.59 41.41,38.05 46.33,38.05 arc-90 46.55,37.82 46.55,37.82 arc90 46.77,37.6 46.81,37.6 arc90 47.04,37.82 47.04,37.82 arc-90 47.26,38.05 47.3,38.05 arc-90 47.52,37.82 47.52,37.82 arc90 47.75,37.6 47.79,37.6 arc90 48.01,37.82 48.01,37.82 arc-90 48.23,38.05 48.27,38.05 arc-90 48.5,37.82 48.5,37.82 arc90 48.72,37.6 48.76,37.6 arc90 48.98,37.82 48.98,37.82 arc-90 49.21,38.05 49.25,38.05 arc-90 49.47,37.82 49.47,37.82 arc90 49.69,37.6 49.73,37.6 arc90 49.96,37.82 49.96,37.82 arc-90 50.18,38.05 50.22,38.05 arc-90 50.44,37.82 50.44,37.82 arc90 50.67,37.6 50.71,37.6 arc90 50.93,37.82 50.93,37.82 arc-90 51.15,38.05 51.2,38.05 arc-90 51.42,37.82 51.42,37.82 arc90 51.64,37.6 51.68,37.6 arc90 51.9,37.82 51.9,37.82 arc-90 52.13,38.05 52.17,38.05 arc-90 52.39,37.82 52.39,37.82 arc90 52.61,37.6 52.66,37.6 arc90 52.88,37.82 52.88,37.82 arc-90 53.1,38.05 70.73,38.05 v71.79,36.99
XHDMI_TX1_P  (via drill 0.25 pad 0.6)
  Top 0.127: IC3.21 | J3.38 40.76,33.04 v40.6,33.1 | v72.3,37.5 73.1,37.5 73.3,37.3 74.36,37.3 IC3.21 | IC3.21 75.76,37.4 77.63,35.52 79.38,35.52 J7.4
  Bottom 0.127: v40.6,33.1 40.4,33.4 40.4,37.4 41.3,38.3 71.5,38.3 v72.3,37.5
XHDMI_TX2_N  (via drill 0.25 pad 0.6)
  Top 0.127: IC3.22 74.5,38 75.58,38 77.57,36.01 J7.3 | J3.35 40.36,33.99 40.14,33.76 v39.8,33.76 | 74.41,38 IC3.22 | IC3.22 73.13,38.05 v72.9,38.27
  Bottom 0.127: v39.8,33.76 39.22,33.76 38.83,34.15 38.83,38.15 40.03,39.35 48.63,39.35 arc-90 48.85,39.12 48.85,39.03 arc90 49.07,38.81 49.2,38.81 arc90 49.42,39.03 49.42,39.12 arc-90 49.65,39.35 49.78,39.35 arc-90 50,39.12 50,39.03 arc90 50.22,38.81 50.35,38.81 arc90 50.58,39.03 50.58,39.12 arc-90 50.8,39.35 71.83,39.35 v72.9,38.27
XHDMI_TX2_P  (via drill 0.25 pad 0.6)
  Top 0.127: J3.36 40.36,32.58 v39.8,33.04 | v72.9,39 73.2,38.7 IC3.23 75.25,38.7 76.95,36.99 79.37,36.99 J7.1
  Bottom 0.127: v39.8,33.04 39.48,33.14 38.57,34.05 38.57,38.25 39.92,39.6 72.3,39.6 v72.9,39
XHDMI_TXC_N  (via drill 0.25 pad 0.6)
  Top 0.127: J3.41 41.56,35.06 42.4,35.9 43,35.9 v43.1,35.8 | v72.7,33.47 74.44,33.47 IC3.15 76.2,33.49 78.19,31.51 J7.12
  Bottom 0.127: v43.1,35.8 43.7,35.8 43.95,36.05 53.66,36.05 arc-90 53.88,35.82 53.88,35.78 arc90 54.1,35.56 54.11,35.56 arc90 54.34,35.78 54.34,35.82 arc-90 54.56,36.05 54.57,36.05 arc-90 54.79,35.82 54.79,35.78 arc90 55.01,35.56 55.02,35.56 arc90 55.25,35.78 55.25,35.82 arc-90 55.47,36.05 55.48,36.05 arc-90 55.7,35.82 55.7,35.78 arc90 55.92,35.56 55.94,35.56 arc90 56.16,35.78 56.16,35.82 arc-90 56.38,36.05 56.39,36.05 arc-90 56.61,35.82 56.61,35.78 arc90 56.83,35.56 56.84,35.56 arc90 57.07,35.78 57.07,35.82 arc-90 57.29,36.05 57.3,36.05 arc-90 57.52,35.82 57.52,35.78 arc90 57.75,35.56 57.75,35.56 arc90 57.98,35.78 57.98,35.82 arc-90 58.2,36.05 69.69,36.05 71.8,33.95 72.15,33.95 72.63,33.47 v72.7,33.47
XHDMI_TXC_P  (via drill 0.25 pad 0.6)
  Top 0.127: 74.5,34.1 IC3.16 | v72.7,34.2 73.8,34.2 73.86,34.15 IC3.16 | J3.42 41.56,32.16 41.7,32.3 v41.7,33 | IC3.16 75.91,34.15 77.56,32.5 79.38,32.5 J7.10
  Bottom 0.127: v72.7,34.2 71.9,34.2 69.8,36.3 42.8,36.3 41.7,35.2 v41.7,33
XI2C_SCL0  (via drill 0.25 pad 0.6, 0.3 pad 0.6)
  Top 0.127: J4.31 39.56,22.63 v39.4,22.8 | v43.79,12.16 44.27,11.68 44.27,9.09 43.46,8.28 41.58,8.28 39.55,6.24 39.55,4.34 SV1.23
  Bottom 0.127: v39.4,22.8 39.4,21.69 40.09,21 40.09,17.94 39.98,17.83 39.98,15.97 v43.79,12.16
XI2C_SCL1  (via drill 0.25 pad 0.6, 0.3 pad 0.6)
  Top 0.127: J4.29 39.16,21.13 v39.6,20.8 | v43.36,10.05 42.24,8.94 39.7,8.94 36.98,6.22 36.98,4.31 SV1.21
  Bottom 0.127: v39.6,20.8 39.6,15.94 42.75,12.8 42.75,10.66 v43.36,10.05
XI2C_SCL2  (via drill 0.25 pad 0.6, 0.3 pad 0.6)
  Top 0.127: J4.27 38.77,20.84 v38.8,20.8 | v42.03,10.59 41.32,9.88 38.07,9.88 34.44,6.24 34.44,4.31 SV1.19
  Bottom 0.127: v38.8,20.8 38.8,16.11 41.91,13 41.91,10.71 v42.03,10.59
XI2C_SDA0
  Top 0.127: J4.32 39.56,16.59 43.15,13 43.15,11.38 43.97,10.56 43.97,9.44 43.13,8.61 41.15,8.61 38.24,5.7 SV1.24
XI2C_SDA1
  Top 0.127: J4.30 39.16,16.4 42.7,12.87 42.7,10.18 41.88,9.37 39.5,9.37 SV1.22
XI2C_SDA2
  Top 0.127: J4.28 38.77,16.19 41.45,13.51 41.45,10.94 40.84,10.33 37.92,10.33 SV1.20
XI2S0_BCLK  (via drill 0.25 pad 0.6)
  Top 0.127: J4.19 37.16,22.41 v37.59,22.83
  Bottom 0.127: v37.59,22.83 36.01,21.25 36.01,12.27 39.93,8.35 50.09,8.35 52.22,6.22 52.22,5.07 53.03,4.26 54.79,4.26 SV1.37
XI2S0_DIN  (via drill 0.25 pad 0.6)
  Top 0.127: 36.78,14.75 v36.77,14.77 J4.18
  Bottom 0.127: v36.77,14.77 36.77,13.9 41.83,8.84 50.22,8.84 SV1.36
XI2S0_DOUT  (via drill 0.25 pad 0.6)
  Top 0.127: J4.17 36.77,22.87 v36.82,22.92
  Bottom 0.127: v36.82,22.92 36.82,22.64 35.66,21.48 35.66,11.73 39.57,7.82 48.13,7.82 49.66,6.3 49.66,5.02 50.37,4.31 52.2,4.31 SV1.35
XI2S0_LRCLK  (via drill 0.25 pad 0.6)
  Top 0.127: J4.15 36.37,22.45 v36.09,22.73 | v36.09,22.73
  Bottom 0.127: v36.09,22.73 35,21.64 35,11.6 39.39,7.21 46.15,7.21 47.14,6.22 47.14,4.92 47.78,4.29 49.68,4.29 SV1.33
XI2S0_MCLK  (via drill 0.25 pad 0.6)
  Top 0.127: v37.51,14.12 37.51,15.08 37.16,15.43 J4.20
  Bottom 0.127: v37.51,14.12 42.31,9.32 52.27,9.32 SV1.38
XNRESET
  Top 0.127: 33,25.9 32.95,25.95
  Top 0.2: 33,25.9 35.56,23.34 J4.11 | 32.95,25.95 16.34,42.56 15.41,42.56 R12.2
XOTG_D_N  (via drill 0.25 pad 0.6)
  Top 0.127: J3.45 42.36,33.74 v42.5,33.6 | v42.95,29.55 43.31,29.2 43.64,29.2 46.09,26.75 60.77,26.75 68.85,18.67 78.75,18.67 81.12,16.3 83.5,16.3 83.75,16.05 J2.D-
  Bottom 0.127: v42.5,33.6 42.5,30.1 42.95,29.65 v42.95,29.55
XOTG_D_P
  Top 0.127: J3.46 42.36,30.84 46.2,27 48.04,27 arc90 48.27,27.22 48.27,27.23 arc-90 48.49,27.45 48.56,27.45 arc-90 48.78,27.23 48.78,27.22 arc90 49,27 49.08,27 arc90 49.3,27.22 49.3,27.23 arc-90 49.52,27.45 49.59,27.45 arc-90 49.81,27.23 49.81,27.22 arc90 50.04,27 50.11,27 arc90 50.33,27.22 50.33,27.23 arc-90 50.55,27.45 50.62,27.45 arc-90 50.85,27.23 50.85,27.22 arc90 51.07,27 51.14,27 arc90 51.36,27.22 51.36,27.23 arc-90 51.59,27.45 51.66,27.45 arc-90 51.88,27.23 51.88,27.22 arc90 52.1,27 52.17,27 arc90 52.4,27.22 52.4,27.23 arc-90 52.62,27.45 52.69,27.45 arc-90 52.91,27.23 52.91,27.22 arc90 53.14,27 53.21,27 arc90 53.43,27.22 53.43,27.23 arc-90 53.65,27.45 53.72,27.45 arc-90 53.94,27.23 53.94,27.22 arc90 54.17,27 54.24,27 arc90 54.46,27.22 54.46,27.23 arc-90 54.68,27.45 54.75,27.45 arc-90 54.98,27.23 54.98,27.22 arc90 55.2,27 60.88,27 68.95,18.93 78.85,18.93 81.19,16.59 83.49,16.59 83.6,16.7 J2.D+
XOTG_ID
  Top 0.127: J3.50 43.16,30.64 46,27.8 60.7,27.8 69.32,19.18 78.96,19.18 80.79,17.35 82.7,17.35 | 82.7,17.35 J2.ID | R14.1 82.75,17.4 82.7,17.35
XPWERKEY
  Top 0.2: J4.9 35.16,22.73 16.93,40.97 13.59,40.97 13.38,41.17 13.38,42.02 R9.2 13.21,41.95
XPWM0
  Top 0.127: J4.26 38.37,16.09 40.38,14.07 40.38,12.21 39.52,11.35 36.4,11.35 SV1.18
XPWM1  (via drill 0.25 pad 0.6, 0.3 pad 0.6)
  Top 0.127: J4.25 38.37,21.14 v38.03,20.8 | v40.82,11.78 39.85,10.82 36.5,10.82 31.93,6.24 31.93,4.34 SV1.17
  Bottom 0.127: v38.03,20.8 38.03,16.35 40.82,13.56 v40.82,11.78
XSD0_CDN  (via drill 0.25 pad 0.6)
  Top 0.127: J4.66 46.37,18.35 46.89,17.83 63.62,17.83 v64.67,16.79 | J8.9 76.62,3.63 75.87,3.63 75.51,3.98 75.51,8.3 75.79,8.58 76.15,8.58 76.47,8.9 76.47,9.56 | R17.1 76.47,9.56 | 76.47,9.56 v76.45,9.55
  Bottom 0.127: v64.67,16.79 69.09,12.36 76.12,12.36 76.45,12.04 v76.45,9.55
XSD0_CLK  (via drill 0.25 pad 0.6)
  Top 0.127: J4.49 43.16,21.14 43.51,20.8 56.87,20.8 58.06,19.6 58.83,19.6 v58.88,19.55 | v70.74,2.18 70.74,0.99 J8.5
  Bottom 0.127: v70.74,2.18 70.74,4.03 69.31,5.46 69.31,10.16 68.78,10.69 64.08,10.69 60.12,14.65 60.12,18.31 v58.88,19.55
XSD0_CMD  (via drill 0.25 pad 0.6)
  Top 0.127: J4.47 42.77,21.13 43.43,20.47 55.37,20.47 57,18.84 v60.81,18.84 | v72.92,2.18 72.92,1 J8.3 | R19.1 70.17,9.53 v70.15,9.52
  Bottom 0.127: v60.81,18.84 61.24,18.41 61.24,14.93 64.95,11.22 70.03,11.22 70.15,11.09 v70.15,9.52 70.15,6.02 72.92,3.25 v72.92,2.18 72.92,2.1
XSD0_D0  (via drill 0.25 pad 0.6)
  Top 0.127: J4.52 43.56,17.84 44.93,16.48 58.59,16.48 58.6,16.48 v58.75,16.48 | J8.7 v68.55,2.2 | R20.1 68.08,9.53 v68.07,9.52
  Bottom 0.127: v58.75,16.48 59.13,16.1 59.13,14.37 63.3,10.21 67.72,10.21 68.07,9.85 v68.07,9.52 68.07,5.36 68.55,4.87 v68.55,2.2 68.58,2.2
XSD0_D1  (via drill 0.25 pad 0.6)
  Top 0.127: J4.51 43.56,21.4 43.79,21.18 57.48,21.18 v57.5,21.2 | v67.44,2.2 67.44,0.99 J8.8 | R18.1 66,9.53 v65.94,9.47
  Bottom 0.127: v67.44,2.2 67.46,2.23 67.46,4.57 65.94,6.09 v65.94,9.47 65.94,9.52 65.68,9.77 62.25,9.77 57.96,14.07 57.96,20.75 v57.5,21.2
XSD0_D2  (via drill 0.25 pad 0.6)
  Top 0.127: J4.50 43.16,17.88 45.02,16.02 54.23,16.02 54.68,15.57 63.93,15.57 v64.39,15.11 | J8.1 75.15,2.16 v75.13,2.18 | R21.1 74.33,9.56 v74.32,9.55
  Bottom 0.127: v75.13,2.18 75.13,4.36 74.32,5.18 v74.32,9.55 74.32,11.76 74.04,12.04 68.35,12.04 65.99,14.4 65.1,14.4 v64.39,15.11
XSD0_D3  (via drill 0.25 pad 0.6)
  Top 0.127: J4.48 42.77,17.92 45.12,15.57 53.11,15.57 53.72,14.96 62.61,14.96 62.94,14.63 v62.94,14.6 | v73.99,2.18 73.99,1.04 J8.2 | R22.1 v72.3,9.56 v72.29,9.55
  Bottom 0.127: 73.99,2.15 v73.99,2.18 73.99,3.7 72.29,5.41 v72.29,9.55 72.29,11.35 71.96,11.68 65.86,11.68 v62.94,14.6
XSPI_CLK  (via drill 0.25 pad 0.6, 0.3 pad 0.6)
  Top 0.127: J4.23 37.97,21.47 v37.3,20.8 | v39.83,12.85 38.73,11.76 34.87,11.76 29.36,6.24 29.36,4.31 SV1.15
  Bottom 0.127: v37.3,20.8 37.3,16.41 39.85,13.86 39.85,12.87 v39.83,12.85
XSPI_CS
  Top 0.127: J4.24 37.97,15.9 39.32,14.55 39.32,13.33 38.28,12.29 34.8,12.29 SV1.16
XSPI_MISO  (via drill 0.25 pad 0.6, 0.3 pad 0.6)
  Top 0.127: J4.21 37.56,21.47 37.4,21.3 36.9,21.3 v36.5,20.8 | v38.71,13.99 38.71,13.3 38.15,12.75 33.4,12.75 26.82,6.17 26.82,4.31 SV1.13
  Bottom 0.127: v36.5,20.8 36.5,16.25 38.76,13.99 | 38.78,13.96 38.76,13.99 | 38.76,13.99 v38.71,13.99
XSPI_MOSI
  Top 0.127: J4.22 37.56,15.64 38.1,15.11 38.1,13.53 37.69,13.13 33.1,13.13 SV1.14
XUART_RX0
  Top 0.127: SV1.32 49.6,6.77 49.6,10.72 42.37,17.96 J4.46
XUART_RX1
  Top 0.127: SV1.30 47.83,7.54 47.83,12.14 41.97,18 J4.44
XUART_TX0  (via drill 0.25 pad 0.6)
  Top 0.127: J4.45 42.37,22.56 42.6,22.8 v42.9,22.8 | SV1.31 49.68,4.31 49.68,6.22 50.29,6.83 50.29,10.84 v46.12,15.01
  Bottom 0.127: v42.9,22.8 44,21.7 44,17.13 v46.12,15.01
XUART_TX1  (via drill 0.25 pad 0.6, 0.3 pad 0.6)
  Top 0.127: v48.33,10.13 48.33,7.46 47.17,6.3 47.17,4.34 SV1.29 | J4.43 41.97,23.2 v42.31,23.54
  Bottom 0.127: 48.31,10.13 v48.33,10.13 47.95,10.51 46.33,10.51 46,10.84 46,12.72 43.48,15.23 43.48,20.52 42.31,21.69 v42.31,23.54
XUSBH_D_N  (via drill 0.25 pad 0.6)
  Top 0.127: J3.47 42.76,34.2 43.36,33.6 v43.46,33.6 | v51.34,35.09 51.99,35.73 51.99,40.53 53.36,41.91 v53.36,42.24
  Bottom 0.127: v43.46,33.6 49.86,33.6 v51.34,35.09 | v53.36,42.24 54.2,43.07 58.52,47.52 59.85,47.52 arc90 60.07,47.74 60.07,47.75 arc-90 60.3,47.98 60.41,47.98 arc-90 60.63,47.75 60.63,47.74 arc90 60.85,47.52 60.96,47.52 arc90 61.18,47.74 61.18,47.75 arc-90 61.41,47.98 61.52,47.98 arc-90 61.74,47.75 61.74,47.74 arc90 61.96,47.52 62.07,47.52 arc90 62.29,47.74 62.29,47.75 arc-90 62.52,47.98 62.63,47.98 arc-90 62.85,47.75 62.85,47.74 arc90 63.07,47.52 63.18,47.52 arc90 63.41,47.74 63.41,47.75 arc-90 63.63,47.98 63.74,47.98 arc-90 63.96,47.75 63.96,47.74 arc90 64.18,47.52 64.29,47.52 arc90 64.52,47.74 64.52,47.75 arc-90 64.74,47.98 64.85,47.98 arc-90 65.07,47.75 65.07,47.74 arc90 65.29,47.52 65.4,47.52 arc90 65.63,47.74 65.63,47.75 arc-90 65.85,47.98 65.96,47.98 arc-90 66.18,47.75 66.18,47.74 arc90 66.4,47.52 66.51,47.52 arc90 66.74,47.74 66.74,47.75 arc-90 66.96,47.98 67.07,47.98 arc-90 67.29,47.75 67.29,47.74 arc90 67.51,47.52 67.62,47.52 arc90 67.85,47.74 67.85,47.75 arc-90 68.07,47.98 68.18,47.98 arc-90 68.4,47.75 68.4,47.74 arc90 68.62,47.52 68.73,47.52 arc90 68.96,47.74 68.96,47.75 arc-90 69.18,47.98 69.29,47.98 arc-90 69.51,47.75 69.51,47.74 arc90 69.73,47.52 69.85,47.52 arc90 70.07,47.74 70.07,47.75 arc-90 70.29,47.98 70.4,47.98 arc-90 70.62,47.75 70.62,47.74 arc90 70.85,47.52 70.96,47.52 arc90 71.18,47.74 71.18,47.75 arc-90 71.4,47.98 71.51,47.98 arc-90 71.73,47.75 71.73,47.74 arc90 71.96,47.52 74.27,47.52 74.83,48.08 75.8,48.08 J5.2
XUSBH_D_P  (via drill 0.25 pad 0.6)
  Top 0.127: J3.48 42.76,31.99 v43.43,32.66 | 51.87,34.54 v51.87,34.56 52.25,34.95 52.25,40.41 53.38,41.56 53.76,41.56 v53.85,41.65
  Bottom 0.127: v43.43,32.66 44.07,33.3 50.59,33.3 v51.87,34.56 | v53.85,41.65 54.3,42.11 54.3,42.62 59.08,47.27 74.85,47.27 75.26,46.86 77.01,46.86 77.47,47.32 77.47,49.5 76.82,50.14 J5.3 76.44,50.14
XVDDPWRON  (via drill 0.3 pad 0.6)
  Top 0.127: J4.38 40.77,17.88 41.68,16.96 v41.68,16.91
  Top 0.2: v28.93,20.39 20.7,20.39 15.14,25.95 R15.2
  Bottom 0.127: v41.68,16.91 41.68,20.37 41.4,20.65 41.4,22.8 40.44,23.77 32.31,23.77 v28.93,20.39

## Text on the board
tPlace: PWR LED | + | 1 | 69 | 2 | 70 | PWR OK / LED | 1 | 69 | RUN / LED | 2 | 70
tNames: FUSE | POWER | USB HOST | 4 | 3 | 2 | 1 | HDMI | USB OTG | TX | RX | WIFI/BT ANT | DEBUG | 3.3V | ADC5 | ADC1 | ADC3 | GP0 | GP2 | MOSI | CS | PWM0 | SDA2 | SDA1 | SDA0 | GP5 | GP7 | RX1 | RX0 | 3.3V | DIN | MCLK | ASDA | AIRQ | 5V | SD | GND | GND | ADC4 | ADC0 | ADC2 | GP1 | GP3 | MISO | CLK | PWM1 | SCL2 | SCL1 | SCL0 | GP4 | GP6 | TX1 | TX0 | LRC | DOUT | BCLK | ASCL | GND | GND
tStop: JORGE GARZA / ARTIK530 / CARRIERBOARD / REV3